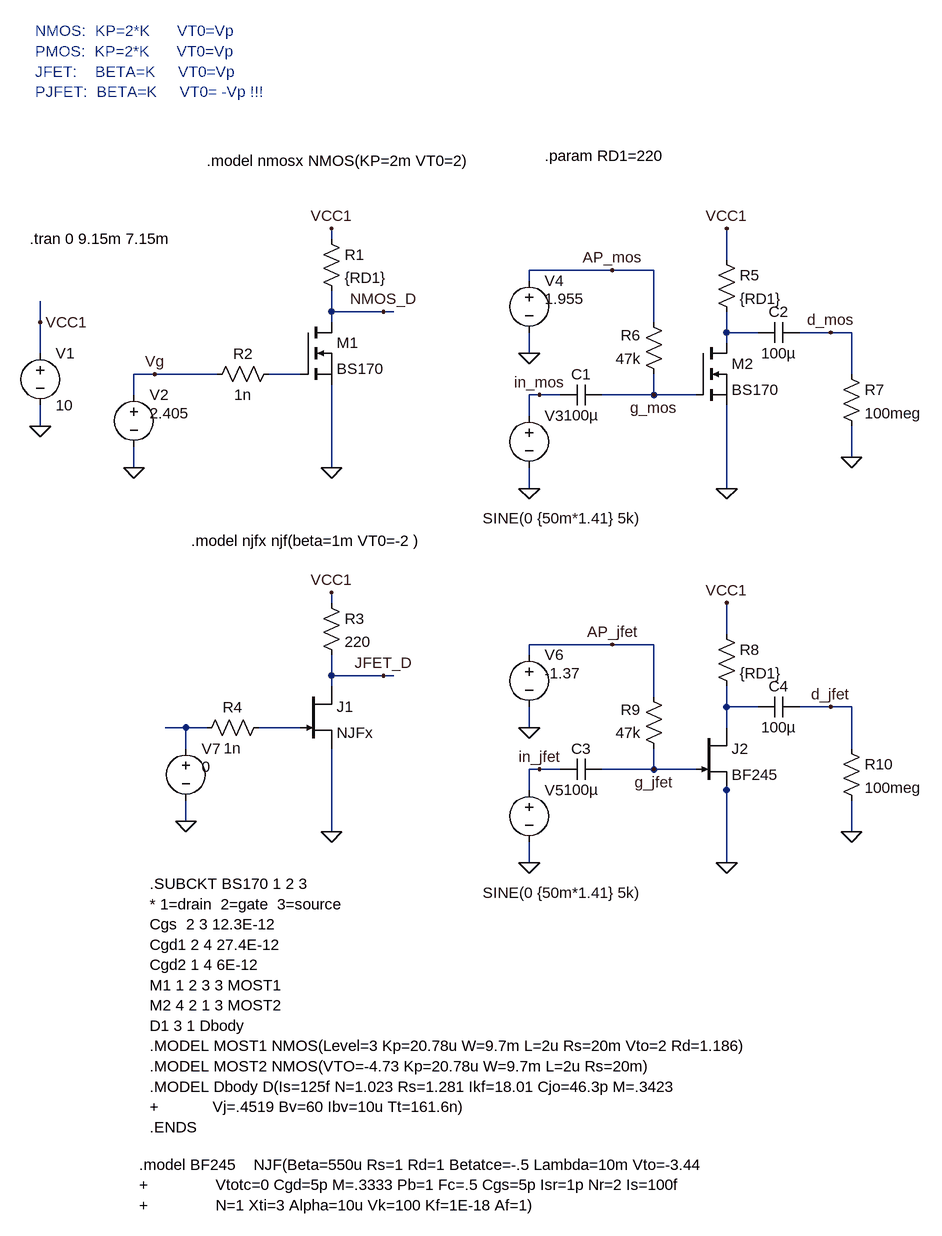
[diagram p0: schematic BS170_gm_plot.asc]
BS170_gm_plot.asc, the LTspice schematic file:
Version 4
SHEET 1 880 680
WIRE -1920 -1472 -1920 -1488
WIRE -1312 -1440 -1312 -1488
WIRE -1488 -1424 -1616 -1424
WIRE -1424 -1424 -1488 -1424
WIRE -1616 -1408 -1616 -1424
WIRE -1920 -1360 -1920 -1392
WIRE -1840 -1360 -1920 -1360
WIRE -1824 -1360 -1840 -1360
WIRE -2368 -1344 -2368 -1376
WIRE -1920 -1344 -1920 -1360
WIRE -1424 -1344 -1424 -1424
WIRE -1312 -1328 -1312 -1360
WIRE -1264 -1328 -1312 -1328
WIRE -1152 -1328 -1200 -1328
WIRE -1120 -1328 -1152 -1328
WIRE -1312 -1312 -1312 -1328
WIRE -2368 -1296 -2368 -1344
WIRE -1616 -1296 -1616 -1328
WIRE -2192 -1264 -2224 -1264
WIRE -2096 -1264 -2192 -1264
WIRE -1968 -1264 -2016 -1264
WIRE -1120 -1264 -1120 -1328
WIRE -2224 -1232 -2224 -1264
WIRE -1600 -1232 -1616 -1232
WIRE -1568 -1232 -1600 -1232
WIRE -1424 -1232 -1424 -1264
WIRE -1424 -1232 -1504 -1232
WIRE -1360 -1232 -1424 -1232
WIRE -1616 -1200 -1616 -1232
WIRE -2368 -1184 -2368 -1216
WIRE -1120 -1136 -1120 -1184
WIRE -2224 -1120 -2224 -1152
WIRE -1920 -1120 -1920 -1248
WIRE -1616 -1088 -1616 -1120
WIRE -1312 -1088 -1312 -1216
WIRE -1920 -912 -1920 -928
WIRE -1312 -864 -1312 -912
WIRE -1488 -848 -1616 -848
WIRE -1424 -848 -1488 -848
WIRE -1616 -832 -1616 -848
WIRE -1920 -800 -1920 -832
WIRE -1840 -800 -1920 -800
WIRE -1824 -800 -1840 -800
WIRE -1920 -784 -1920 -800
WIRE -1424 -768 -1424 -848
WIRE -1312 -752 -1312 -784
WIRE -1264 -752 -1312 -752
WIRE -1152 -752 -1200 -752
WIRE -1120 -752 -1152 -752
WIRE -2144 -720 -2176 -720
WIRE -2112 -720 -2144 -720
WIRE -1968 -720 -2032 -720
WIRE -1616 -720 -1616 -752
WIRE -1312 -720 -1312 -752
WIRE -2144 -688 -2144 -720
WIRE -1120 -688 -1120 -752
WIRE -1600 -656 -1616 -656
WIRE -1568 -656 -1600 -656
WIRE -1424 -656 -1424 -688
WIRE -1424 -656 -1504 -656
WIRE -1360 -656 -1424 -656
WIRE -1616 -624 -1616 -656
WIRE -1312 -624 -1312 -640
WIRE -2144 -576 -2144 -608
WIRE -1920 -560 -1920 -688
WIRE -1120 -560 -1120 -608
WIRE -1616 -512 -1616 -544
WIRE -1312 -512 -1312 -624
FLAG -1920 -1120 0
FLAG -2368 -1184 0
FLAG -2224 -1120 0
FLAG -2368 -1344 VCC1
FLAG -1920 -1488 VCC1
FLAG -1920 -560 0
FLAG -1920 -928 VCC1
FLAG -2192 -1264 Vg
FLAG -1840 -800 JFET_D
FLAG -1840 -1360 NMOS_D
FLAG -1312 -1088 0
FLAG -1616 -1088 0
FLAG -1312 -1488 VCC1
FLAG -1616 -1296 0
FLAG -1488 -1424 AP_mos
FLAG -1424 -1232 g_mos
FLAG -1152 -1328 d_mos
FLAG -1600 -1232 in_mos
FLAG -1120 -1136 0
FLAG -1312 -512 0
FLAG -1616 -512 0
FLAG -1312 -912 VCC1
FLAG -1616 -720 0
FLAG -1488 -848 AP_jfet
FLAG -1424 -656 g_jfet
FLAG -1152 -752 d_jfet
FLAG -1600 -656 in_jfet
FLAG -1120 -560 0
FLAG -2144 -576 0
SYMBOL voltage -2368 -1312 R0
WINDOW 123 0 0 Left 2
WINDOW 39 0 0 Left 2
SYMATTR InstName V1
SYMATTR Value 10
SYMBOL res -1936 -1488 R0
SYMATTR InstName R1
SYMATTR Value {RD1}
SYMBOL voltage -2224 -1248 R0
WINDOW 123 0 0 Left 2
WINDOW 39 0 0 Left 2
WINDOW 3 24 44 Left 2
SYMATTR Value 2.405
SYMATTR InstName V2
SYMBOL res -2000 -1280 R90
WINDOW 0 0 56 VBottom 2
WINDOW 3 32 56 VTop 2
SYMATTR InstName R2
SYMATTR Value 1n
SYMBOL nmos -1968 -1344 R0
SYMATTR InstName M1
SYMATTR Value BS170
SYMATTR Prefix X
SYMBOL njf -1968 -784 R0
SYMATTR InstName J1
SYMATTR Value NJFx
SYMBOL res -1936 -928 R0
SYMATTR InstName R3
SYMATTR Value 220
SYMBOL res -2016 -736 R90
WINDOW 0 0 56 VBottom 2
WINDOW 3 32 56 VTop 2
SYMATTR InstName R4
SYMATTR Value 1n
SYMBOL res -1328 -1456 R0
SYMATTR InstName R5
SYMATTR Value {RD1}
SYMBOL voltage -1616 -1216 R0
WINDOW 123 0 0 Left 2
WINDOW 39 0 0 Left 2
WINDOW 3 -71 174 Left 2
SYMATTR Value SINE(0 {50m*1.41} 5k)
SYMATTR InstName V3
SYMBOL res -1408 -1248 R180
WINDOW 0 36 76 Left 2
WINDOW 3 36 40 Left 2
SYMATTR InstName R6
SYMATTR Value 47k
SYMBOL cap -1504 -1248 R90
WINDOW 0 0 32 VBottom 2
WINDOW 3 32 32 VTop 2
SYMATTR InstName C1
SYMATTR Value 100µ
SYMBOL voltage -1616 -1424 R0
WINDOW 123 0 0 Left 2
WINDOW 39 0 0 Left 2
WINDOW 3 24 44 Left 2
SYMATTR Value 1.955
SYMATTR InstName V4
SYMBOL cap -1200 -1344 R90
WINDOW 0 0 32 VBottom 2
WINDOW 3 32 32 VTop 2
SYMATTR InstName C2
SYMATTR Value 100µ
SYMBOL res -1136 -1280 R0
SYMATTR InstName R7
SYMATTR Value 100meg
SYMBOL nmos -1360 -1312 R0
SYMATTR InstName M2
SYMATTR Value BS170
SYMATTR Prefix X
SYMBOL res -1328 -880 R0
SYMATTR InstName R8
SYMATTR Value {RD1}
SYMBOL res -1408 -672 R180
WINDOW 0 36 76 Left 2
WINDOW 3 36 40 Left 2
SYMATTR InstName R9
SYMATTR Value 47k
SYMBOL cap -1504 -672 R90
WINDOW 0 0 32 VBottom 2
WINDOW 3 32 32 VTop 2
SYMATTR InstName C3
SYMATTR Value 100µ
SYMBOL cap -1200 -768 R90
WINDOW 0 0 32 VBottom 2
WINDOW 3 32 32 VTop 2
SYMATTR InstName C4
SYMATTR Value 100µ
SYMBOL res -1136 -704 R0
SYMATTR InstName R10
SYMATTR Value 100meg
SYMBOL voltage -1616 -640 R0
WINDOW 123 0 0 Left 2
WINDOW 39 0 0 Left 2
WINDOW 3 -71 174 Left 2
SYMATTR Value SINE(0 {50m*1.41} 5k)
SYMATTR InstName V5
SYMBOL voltage -1616 -848 R0
WINDOW 123 0 0 Left 2
WINDOW 39 0 0 Left 2
WINDOW 3 24 44 Left 2
SYMATTR Value -1.37
SYMATTR InstName V6
SYMBOL njf -1360 -720 R0
SYMATTR InstName J2
SYMATTR Value BF245
SYMBOL voltage -2144 -704 R0
WINDOW 123 0 0 Left 2
WINDOW 39 0 0 Left 2
WINDOW 3 24 44 Left 2
SYMATTR Value 0
SYMATTR InstName V7
TEXT -2384 -1472 Left 2 !.tran 0 9.15m 7.15m
TEXT -2112 -1592 Left 2 !.model nmosx NMOS(KP=2m VT0=2)
TEXT -2136 -1008 Left 2 !.model njfx njf(beta=1m VT0=-2 )
TEXT -2376 -1792 Left 2 ;NMOS:  KP=2*K      VT0=Vp\nPMOS:  KP=2*K      VT0=Vp\nJFET:    BETA=K     VT0=Vp\nPJFET:  BETA=K     VT0= -Vp !!!
TEXT -1592 -1600 Left 2 !.param RD1=220
TEXT -2200 -480 Left 2 !.SUBCKT BS170 1 2 3\n* 1=drain  2=gate  3=source\nCgs  2 3 12.3E-12\nCgd1 2 4 27.4E-12\nCgd2 1 4 6E-12\nM1 1 2 3 3 MOST1\nM2 4 2 1 3 MOST2\nD1 3 1 Dbody\n.MODEL MOST1 NMOS(Level=3 Kp=20.78u W=9.7m L=2u Rs=20m Vto=2 Rd=1.186)\n.MODEL MOST2 NMOS(VTO=-4.73 Kp=20.78u W=9.7m L=2u Rs=20m)\n.MODEL Dbody D(Is=125f N=1.023 Rs=1.281 Ikf=18.01 Cjo=46.3p M=.3423\n+            Vj=.4519 Bv=60 Ibv=10u Tt=161.6n)\n.ENDS
TEXT -2216 -48 Left 2 !.model BF245    NJF(Beta=550u Rs=1 Rd=1 Betatce=-.5 Lambda=10m Vto=-3.44\n+               Vtotc=0 Cgd=5p M=.3333 Pb=1 Fc=.5 Cgs=5p Isr=1p Nr=2 Is=100f\n+               N=1 Xti=3 Alpha=10u Vk=100 Kf=1E-18 Af=1)

The netlist it stands for:
* BS170_gm_plot.asc
V1 VCC1 0 10
R1 VCC1 NMOS_D {RD1}
V2 Vg 0 2.405
R2 N002 Vg 1n
XM1 NMOS_D N002 0 BS170  ; pins D G S
J1 JFET_D N005 0 NJFx
R3 VCC1 JFET_D 220
R4 N005 N004 1n
R5 VCC1 N001 {RD1}
V3 in_mos 0 SINE(0 {50m*1.41} 5k)
R6 g_mos AP_mos 47k
C1 g_mos in_mos 100µ
V4 AP_mos 0 1.955
C2 d_mos N001 100µ
R7 d_mos 0 100meg
XM2 N001 g_mos 0 BS170  ; pins D G S
R8 VCC1 N003 {RD1}
R9 g_jfet AP_jfet 47k
C3 g_jfet in_jfet 100µ
C4 d_jfet N003 100µ
R10 d_jfet 0 100meg
V5 in_jfet 0 SINE(0 {50m*1.41} 5k)
V6 AP_jfet 0 -1.37
J2 N003 g_jfet 0 BF245
V7 N004 0 0
.model NJF NJF
.model PJF PJF
.lib standard.jft
.tran 0 9.15m 7.15m
.model nmosx NMOS(KP=2m VT0=2)
.model njfx njf(beta=1m VT0=-2 )
* NMOS:  KP=2*K      VT0=Vp
* PMOS:  KP=2*K      VT0=Vp
* JFET:    BETA=K     VT0=Vp
* PJFET:  BETA=K     VT0= -Vp !!!
.param RD1=220
.SUBCKT BS170 1 2 3
* 1=drain  2=gate  3=source
Cgs  2 3 12.3E-12
Cgd1 2 4 27.4E-12
Cgd2 1 4 6E-12
M1 1 2 3 3 MOST1
M2 4 2 1 3 MOST2
D1 3 1 Dbody
.MODEL MOST1 NMOS(Level=3 Kp=20.78u W=9.7m L=2u Rs=20m Vto=2 Rd=1.186)
.MODEL MOST2 NMOS(VTO=-4.73 Kp=20.78u W=9.7m L=2u Rs=20m)
.MODEL Dbody D(Is=125f N=1.023 Rs=1.281 Ikf=18.01 Cjo=46.3p M=.3423
+            Vj=.4519 Bv=60 Ibv=10u Tt=161.6n)
.ENDS
.model BF245    NJF(Beta=550u Rs=1 Rd=1 Betatce=-.5 Lambda=10m Vto=-3.44
+               Vtotc=0 Cgd=5p M=.3333 Pb=1 Fc=.5 Cgs=5p Isr=1p Nr=2 Is=100f
+               N=1 Xti=3 Alpha=10u Vk=100 Kf=1E-18 Af=1)
.backanno
.end